# EasyEDA Pro project ProPrj_小车主板_2025-11-23.epro

# Schematic Schematic1
Board Name: Board1; Create Date: 2025-10-30; Page Name: P1; Project Name: 小车主板; Schematic Name: Schematic1; Update Date: 2025-11-07; Company: 嘉立创EDA; Page Size: A4; Version: V1.0
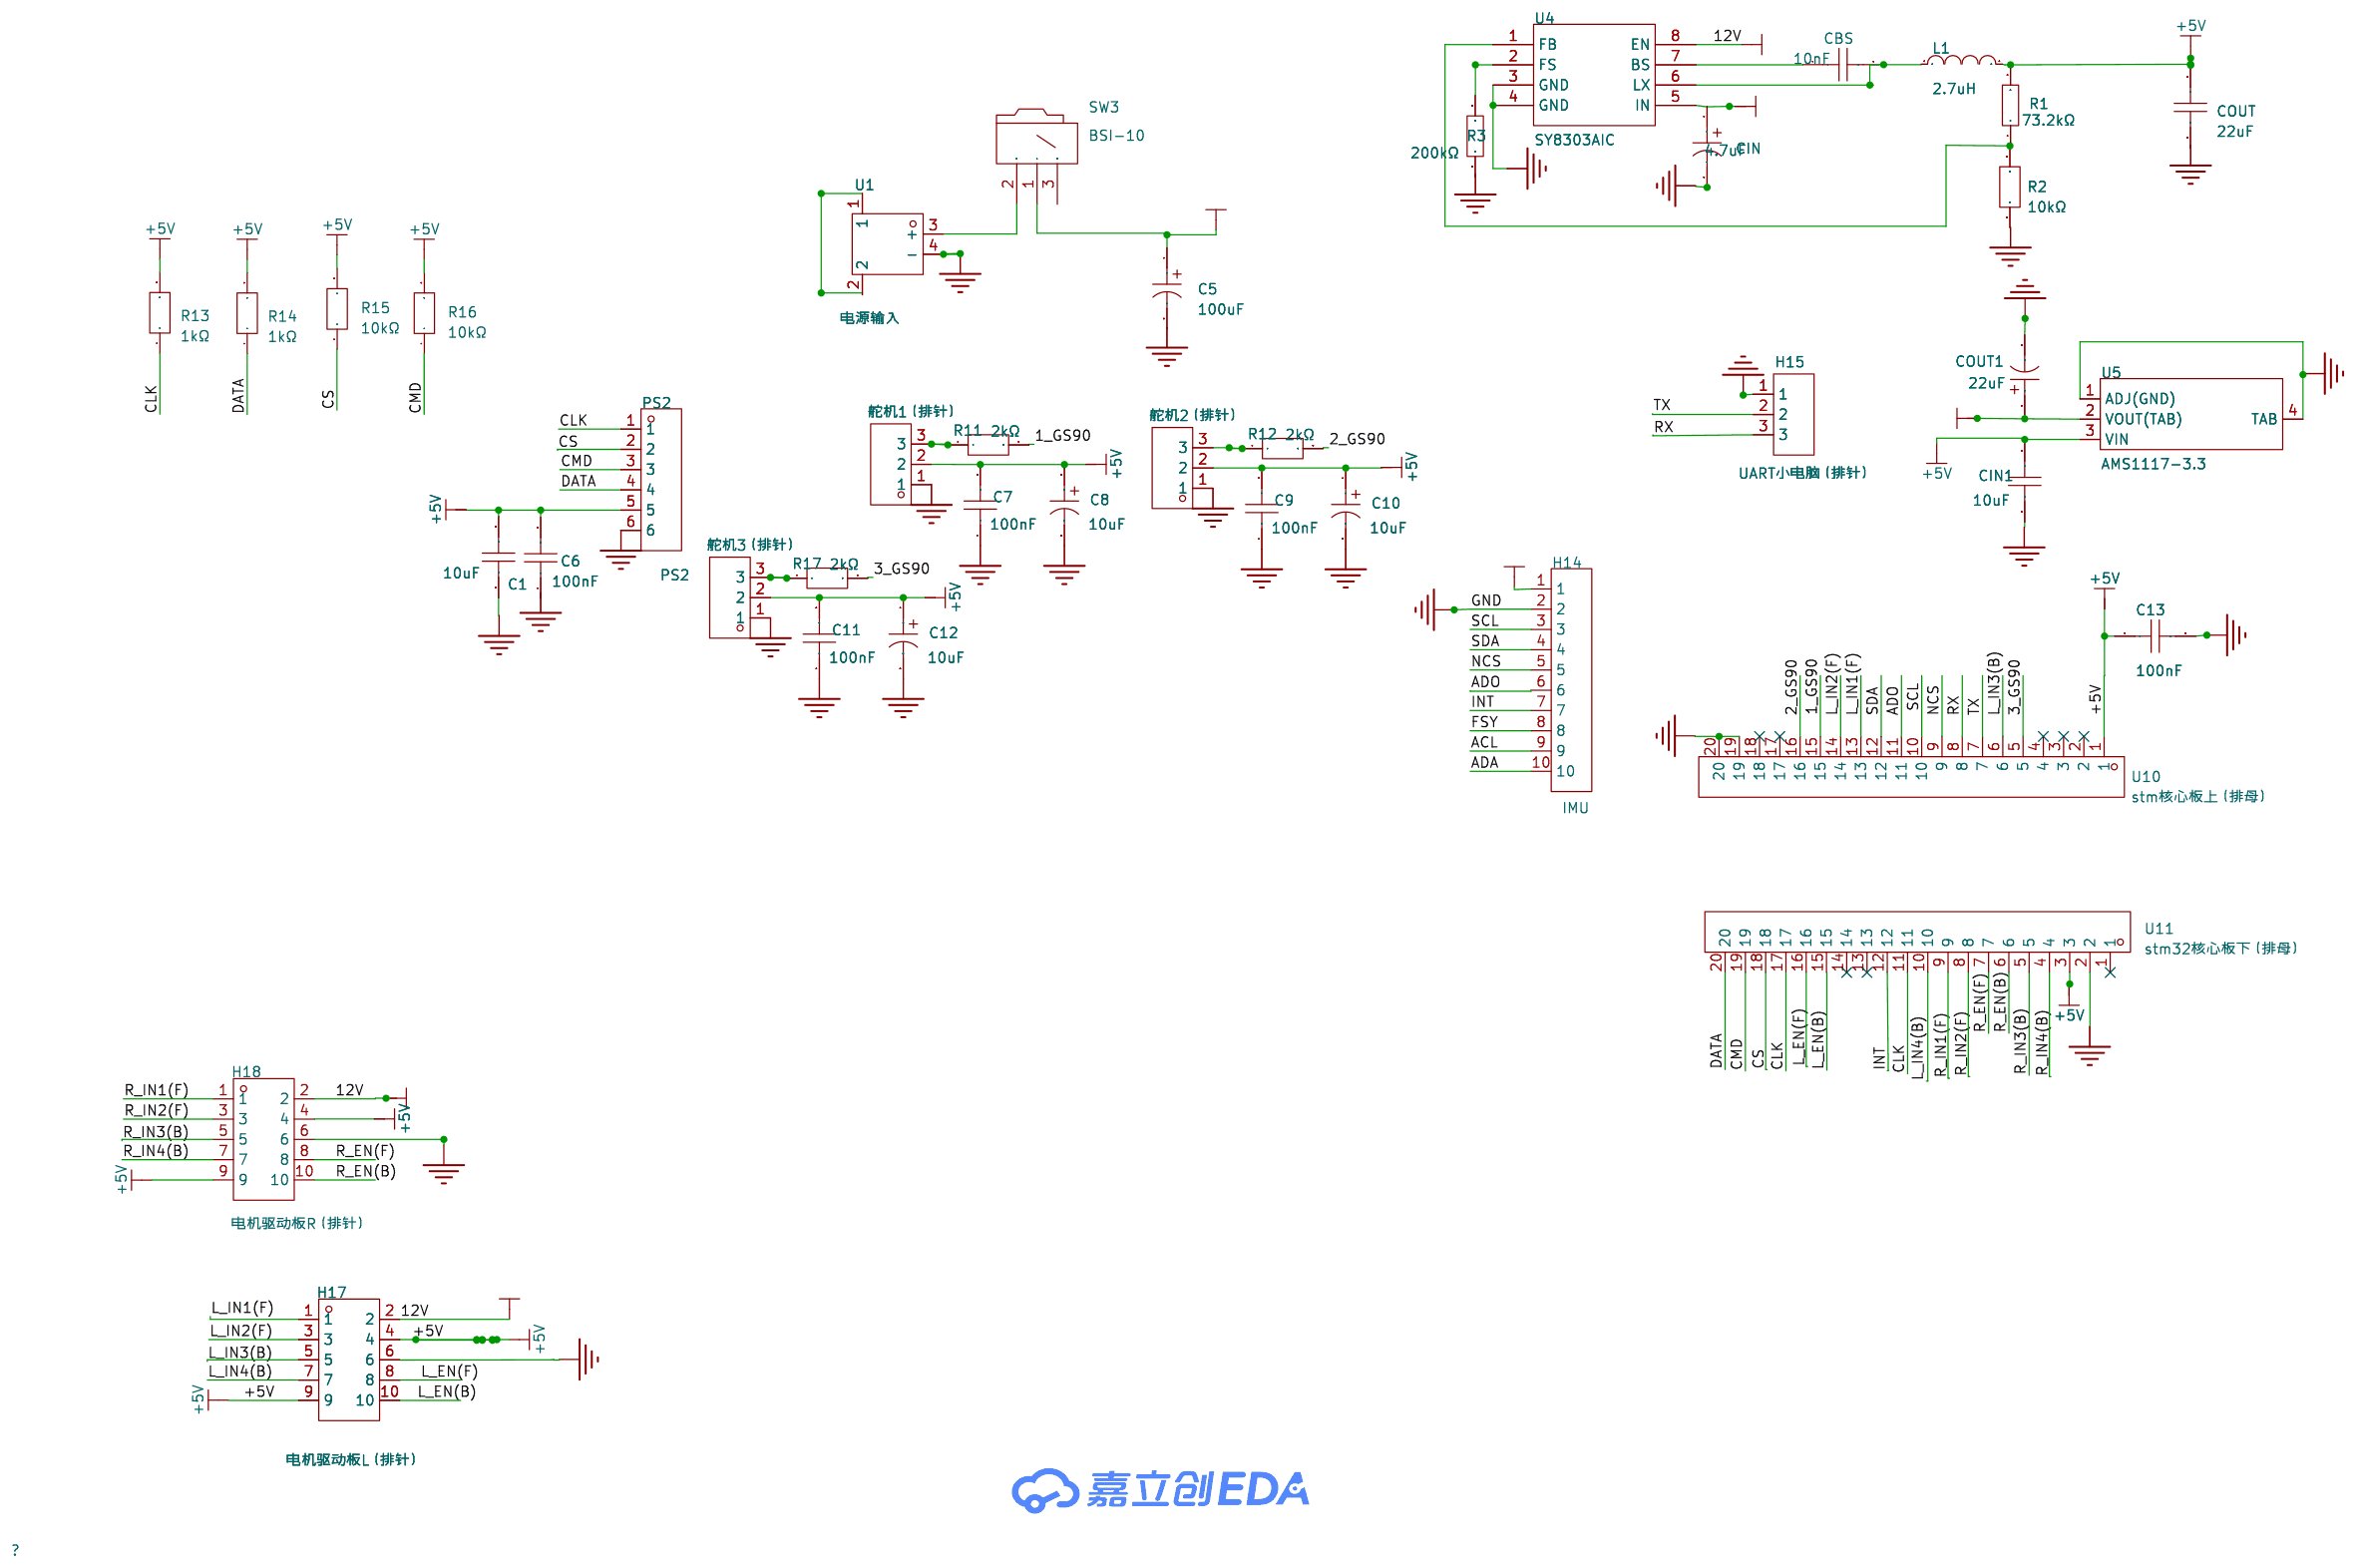
[diagram p0: schematic sheet]

## Parts
C1  10uF  [C1206]
C5  100uF  [CAP-SMD_BD6.3-L6.6-W6.6-FD-1]
C6  100nF  [CAP-TH_L5.0-W2.5-P5.00-D1.0]
C7  100nF  [C0603]
C8  10uF  [CAP-SMD_BD4.0-L4.3-W4.3-FD]
C9  100nF  [C0603]
C10  10uF  [CAP-SMD_BD4.0-L4.3-W4.3-FD]
C11  100nF  [C0603]
C12  10uF  [CAP-SMD_BD4.0-L4.3-W4.3-FD]
C13  100nF  [C0603]
CBS  10nF  [C0402]
CIN  4.7uF  [CAP-SMD_L3.2-W1.6]
CIN1  10uF  [C1206]
COUT  22uF  [C0603]
COUT1  22uF  [CAP-SMD_BD4.0-L4.3-W4.3-FD_1]
H14  IMU  [HDR-TH_10P-P2.54-V-M]
H15  UART小电脑（排针）  [HDR-TH_3P-P2.54-V-M]
H17  电机驱动板L（排针）  [HDR-TH_10P-P2.54-V-M-R2-C5-S2.54-1]
H18  电机驱动板R（排针）  [HDR-TH_10P-P2.54-V-M-R2-C5-S2.54-1]
L1  2.7uH  [IND-SMD_L4.0-W4.0_FNR40XXS]
PS2  PS2  [HDR-TH_6P-P2.54-V-F]
R1  73.2kΩ  [R0402]
R2  10kΩ  [R0603]
R3  200kΩ  [R0603]
R11  2kΩ  [R0603]
R12  2kΩ  [R0603]
R13  1kΩ  [R0603]
R14  1kΩ  [R0603]
R15  10kΩ  [R0603]
R16  10kΩ  [R0603]
R17  2kΩ  [R0603]
SW3  BSI-10  [SW-TH_BSI-10]
U1  电源输入  [TH_2P-XT60PW-F]
U4  SY8303AIC  [TSOT-23-8_L2.9-W1.6-P0.65-LS2.8-BR]
U5  AMS1117-3.3  [SOT-223-4_L6.5-W3.5-P2.30-LS7.0-BR]
U10  stm核心板上（排母）  [HDR-TH_20P-P2.54-V-F]
U11  stm32核心板下（排母）  [HDR-TH_20P-P2.54-V-F]
舵机1（排针）  -  [HDR-TH_3P-P2.54-V-M]
舵机2（排针）  -  [HDR-TH_3P-P2.54-V-M]
舵机3（排针）  -  [HDR-TH_3P-P2.54-V-M]

## Library data of the parts
C1 CIN1 = CL31B106KBHNNNE: 容值:10uF;精度:±10%;额定电压:50V;温度系数:X7R;; LCSC Part Name: 10uF ±10% 50V; Supplier Part: C89632; Manufacturer: SAMSUNG(三星); Supplier Footprint: 1206; JLCPCB Part Class: 扩展库; Datasheet: https://item.szlcsc.com/datasheet/CL31B106KBHNNNE/90812.html; Supplier: LCSC; Tolerance: ±10%; Voltage Rating: 50V; Temperature Coefficient: X7R
C5 = JVJ25V100M6x5: 容值:100uF;精度:±20%;额定电压:25V;纹波电流:72mA@120Hz;; LCSC Part Name: 100uF ±20% 25V; Supplier Part: C46550402; Manufacturer: JIERR(捷而瑞); Supplier Footprint: SMD,D6.3xL5.4mm; JLCPCB Part Class: 扩展库; Datasheet: https://item.szlcsc.com/datasheet/JVJ25V100M6x5/48680096.html; Supplier: LCSC; Tolerance: ±20%; Voltage Rating: 25V; Ripple Current: 72mA@120Hz; Diameter: 6.3mm; Height - Seated (Max): 5.4mm; Lifetime: 2000hrs@105℃; Operating Temperature: -55℃~+105℃
C6 = CC1H104MC1FD3F6C10MF: 容值:100nF;精度:±20%;额定电压:50V;温度系数:Y5V;; LCSC Part Name: 100nF ±20% 50V; Supplier Part: C254085; Manufacturer: Dersonic(德尔创); Supplier Footprint: 插件,P=5.08mm; JLCPCB Part Class: 扩展库; Datasheet: https://item.szlcsc.com/datasheet/CC1H104MC1FD3F6C10MF/248635.html; Supplier: LCSC; Tolerance: ±20%; Voltage Rating: 50V; Pin Spacing: 5.08mm; Temperature Coefficient: Y5V; Diameter: 6mm; Body Thickness: 2.2mm
C7 C9 C11 C13 = CC0603KRX7R9BB104: 容值:100nF;精度:±10%;额定电压:50V;温度系数:X7R;; LCSC Part Name: 100nF ±10% 50V; Supplier Part: C14663; Manufacturer: YAGEO(国巨); Supplier Footprint: 0603; Datasheet: https://item.szlcsc.com/datasheet/CC0603KRX7R9BB104/15331.html; Supplier: LCSC; Tolerance: ±10%; Voltage Rating: 50V; Temperature Coefficient: X7R
C8 C10 C12 = JVJ35V10M4x5: 容值:10uF;精度:±20%;额定电压:35V;纹波电流:14mA@120Hz;; LCSC Part Name: 10uF ±20% 35V; Supplier Part: C46550410; Manufacturer: JIERR(捷而瑞); Supplier Footprint: SMD,D4xL5.4mm; JLCPCB Part Class: 扩展库; Datasheet: https://item.szlcsc.com/datasheet/JVJ35V10M4x5/48680104.html; Supplier: LCSC; Tolerance: ±20%; Voltage Rating: 35V; Ripple Current: 14mA@120Hz; Diameter: 4mm; Height - Seated (Max): 5.4mm; Lifetime: 2000hrs@105℃; Operating Temperature: -55℃~+105℃
CBS = TMK105B7103KVHF: 容值:10nF;精度:±10%;额定电压:25V;材质(温度系数):X7R;; LCSC Part Name: MBAST105SB7103KFNA01 10nF ±10% 25V; Supplier Part: C650944; Manufacturer: TAIYO YUDEN(太诱); Supplier Footprint: 0402; JLCPCB Part Class: 扩展库; Datasheet: https://atta.szlcsc.com/upload/public/pdf/source/20200616/C651025_03129E9EA2F0E607D4931456AA98AFBB.pdf; Supplier: LCSC; Tolerance: ±10%; Voltage Rating: 25V; Temperature Coefficient: X7R
CIN = CA45-A-16V-4.7uF-K_C503895: 容值:4.7uF;精度:±10%;额定电压:16V;等效串联电阻(ESR):4Ω@100kHz;; LCSC Part Name: 4.7uF ±10% 16V; Supplier Part: C503895; Manufacturer: TORCH(火炬); Manufacturer Part: CA45-A-16V-4.7uF-K; Supplier Footprint: CASE-A-3216-16(mm); JLCPCB Part Class: 扩展库; Datasheet: https://item.szlcsc.com/datasheet/CA45-A-16V-4.7uF-K/516604.html; Supplier: LCSC; Tolerance: ±10%; Voltage Rating: 16V; Equivalent Series Resistance(ESR): 4Ω@100kHz; Operating Temperature: -55℃~+125℃
COUT = CL10A226MQ8NRNE: 容值:22uF;精度:±20%;额定电压:6.3V;温度系数:X5R;; LCSC Part Name: 22uF ±20% 6.3V; Supplier Part: C159801; Manufacturer: SAMSUNG(三星); Supplier Footprint: 0603; JLCPCB Part Class: 扩展库; Datasheet: https://item.szlcsc.com/datasheet/CL10A226MQ8NRNE/171181.html; Supplier: LCSC; Tolerance: ±20%; Voltage Rating: 6.3V; Temperature Coefficient: X5R
COUT1 = JVJ16V22M4X5: 容值:22uF;精度:±20%;额定电压:16V;纹波电流:20mA@120Hz;; LCSC Part Name: 22uF ±20% 16V; Supplier Part: C46550398; Manufacturer: JIERR(捷而瑞); Supplier Footprint: SMD,D4xL5.4mm; JLCPCB Part Class: 扩展库; Datasheet: https://item.szlcsc.com/datasheet/JVJ16V22M4X5/48680092.html; Supplier: LCSC; Tolerance: ±20%; Voltage Rating: 16V; Ripple Current: 20mA@120Hz; Diameter: 4mm; Height - Seated (Max): 5.4mm; Lifetime: 2000hrs@105℃; Operating Temperature: -55℃~+105℃
H14 = PZ254V-11-10P: 插针结构:1x10P;间距:2.54mm;行距:-;圆针/方针:方针;安装方式:直插;排数:单排;总PIN位数:10P;额定电流:-;额定电压:-;配合针长度:6mm;塑高:2.5mm;端接针长度:3mm;触头材质:黄铜;触头镀层:-;工作温度:-40℃~+105℃;颜色:黑色;; LCSC Part Name: 1x10P 间距:2.54mm 方针 直插; Supplier Part: C492409; Manufacturer: XFCN(兴飞); Supplier Footprint: 插件,P=2.54mm; JLCPCB Part Class: 扩展库; Datasheet: https://atta.szlcsc.com/upload/public/pdf/source/20200309/C492409_129C9431BDD62EBBBD0A643B6AAB9FBD.pdf; Supplier: LCSC; Pin Structure: 1x10P; Pitch: 2.54mm; Circluar Pins/Square Pins: 方针; Mounting Type: 直插; Number of Rows: 单排; Number of Pins: 10P; Length of Mating Pin: 6mm; Insulation Height: 2.5mm; Length of End Connection Pin: 3mm; Contact Material: 黄铜; Operating Temperature: -40℃~+105℃; Color: 黑色
H15 = PZ254V-11-03P: 插针结构:1x3P;间距:2.54mm;行距:-;圆针/方针:方针;安装方式:直插;排数:单排;总PIN位数:3P;额定电流:3A;额定电压:250V;配合针长度:6mm;塑高:2.5mm;端接针长度:3mm;工作温度:-40℃~+105℃;颜色:黑色;; LCSC Part Name: 1x3P 间距:2.54mm 方针 直插; Supplier Part: C2937625; Manufacturer: XFCN(兴飞); Supplier Footprint: 插件,P=2.54mm; JLCPCB Part Class: 扩展库; Datasheet: https://item.szlcsc.com/datasheet/PZ254V-11-03P/3293280.html; Supplier: LCSC; Pin Structure: 1x3P; Pitch: 2.54mm; Circluar Pins/Square Pins: 方针; Mounting Type: 直插; Number of Rows: 单排; Number of Pins: 3P; Current Rating: 3A; Voltage Rating (Max): 250V; Length of Mating Pin: 6mm; Insulation Height: 2.5mm; Length of End Connection Pin: 3mm; Operating Temperature: -40℃~+105℃; Color: 黑色
H17 H18 = PZ2.54-2*5: 插针结构:2x5P;间距:2.54mm;行距:2.54mm;圆针/方针:方针;安装方式:直插;排数:双排;总PIN位数:10P;额定电流:2.5A;配合针长度:6mm;塑高:2.54mm;端接针长度:3mm;触头材质:黄铜;触头镀层:金;工作温度:-40℃~+105℃;; LCSC Part Name: 2x5P 间距:2.54mm 方针 直插; Supplier Part: C5156677; Manufacturer: ZHOURI(洲日); Supplier Footprint: 插件,P=2.54mm; Datasheet: https://item.szlcsc.com/datasheet/PZ2.54-2*5/5790846.html; Supplier: LCSC; Pin Structure: 2x5P; Pitch: 2.54mm; Row Spacing: 2.54mm; Circluar Pins/Square Pins: 方针; Mounting Type: 直插; Number of Rows: 双排; Number of Pins: 10P; Current Rating: 2.5A; Length of Mating Pin: 6mm; Insulation Height: 2.54mm; Length of End Connection Pin: 3mm; Contact Material: 黄铜; Contact Plating: 金; Operating Temperature: -40℃~+105℃
L1 = FNR4012S2R7NT: 电感值:2.7uH;精度:±30%;额定电流:1.7A;饱和电流(Isat):2.3A;; LCSC Part Name: 2.7uH ±30% 2.3A; Supplier Part: C167777; Manufacturer: cjiang(长江微电); Supplier Footprint: SMD,4x4mm; JLCPCB Part Class: 扩展库; Datasheet: https://atta.szlcsc.com/upload/public/pdf/source/20190327/C167925_9EFF0AABC4CA629C2CC95961DBF7D39D.pdf; Supplier: LCSC; Tolerance: ±30%; Rated Current: 1.7A; Saturation Current (Isat): 2.3A; DC Resistance (DCR): 117mΩ
PS2 = 2.54-1*6P母: 插孔结构:1x6P;间距:2.54mm;行距:-;圆孔/方孔:方孔;安装方式:直插;排数:单排;总孔位数:6P;额定电流:3A;额定电压:-;插孔方向:顶部;塑高:-;触头材质:-;触头镀层:-;工作温度:-40℃~+105℃;; LCSC Part Name: 1x6P 间距:2.54mm 直插; Supplier Part: C40877; Manufacturer: BOOMELE(博穆精密); Supplier Footprint: 插件,P=2.54mm; JLCPCB Part Class: 扩展库; Datasheet: https://item.szlcsc.com/datasheet/2.54-1*6P%25E6%25AF%258D/41861.html; Supplier: LCSC; Holes Structure: 1x6P; Pitch: 2.54mm; Circular Hole / Square Hole: 方孔; Mounting Type: 直插; Number of Rows: 单排; Number of Positions: 6P; Current Rating: 3A; Holes Direction: 顶部; Operating Temperature: -40℃~+105℃
R1 = 0402WGF7322TCE: 电阻类型:厚膜电阻;阻值:73.2kΩ;精度:±1%;功率:62.5mW;工作电压:50V;温度系数:±100ppm/℃;; LCSC Part Name: 73.2kΩ ±1% 62.5mW 厚膜电阻; Supplier Part: C26986; Manufacturer: UNI-ROYAL(厚声); Supplier Footprint: 0402; JLCPCB Part Class: 扩展库; Datasheet: https://item.szlcsc.com/datasheet/0402WGF7322TCE/27735.html; Supplier: LCSC; Type: 厚膜电阻; Tolerance: ±1%; Power(Watts): 62.5mW; Voltage-Supply(Max): 50V; Temperature Coefficient: ±100ppm/℃; Operating Temperature: -55℃~+155℃
R2 R15 R16 = FRC0603J103 TS: 电阻类型:厚膜电阻;阻值:10kΩ;精度:±5%;功率:100mW;工作电压:75V;温度系数:±100ppm/℃;; LCSC Part Name: 10kΩ ±5% 100mW 厚膜电阻; Supplier Part: C2930027; Manufacturer: FOJAN(富捷); Supplier Footprint: 0603; JLCPCB Part Class: 扩展库; Datasheet: https://item.szlcsc.com/datasheet/FRC0603J103%2520TS/3266960.html; Supplier: LCSC; Type: 厚膜电阻; Tolerance: ±5%; Power(Watts): 100mW; Voltage-Supply(Max): 75V; Temperature Coefficient: ±100ppm/℃; Operating Temperature: -55℃~+155℃
R3 = 0603WAF2003T5E: 电阻类型:厚膜电阻;阻值:200kΩ;精度:±1%;功率:100mW;最大工作电压:75V;温度系数:±100ppm/℃;; LCSC Part Name: 200kΩ ±1% 100mW 厚膜电阻; Supplier Part: C25811; Manufacturer: UNI-ROYAL(厚声); Supplier Footprint: 0603; JLCPCB Part Class: 基础库; Datasheet: https://atta.szlcsc.com/upload/public/pdf/source/20200306/C422600_1E6D84923E4A46A82E41ADD87F860B5C.pdf; Supplier: LCSC; Type: 厚膜电阻; Tolerance: ±1%; Power(Watts): 100mW; Overload Voltage (Max): 75V; Temperature Coefficient: ±100ppm/℃; Operating Temperature Range: -55℃~+155℃
R11 R12 R17 = FRC0603J202 TS: 电阻类型:厚膜电阻;阻值:2kΩ;精度:±5%;功率:100mW;工作电压:75V;温度系数:±100ppm/℃;; LCSC Part Name: 2kΩ ±5% 100mW 厚膜电阻; Supplier Part: C2907137; Manufacturer: FOJAN(富捷); Supplier Footprint: 0603; Supplier: LCSC; Type: 厚膜电阻; Tolerance: ±5%; Power(Watts): 100mW; Voltage-Supply(Max): 75V; Temperature Coefficient: ±100ppm/℃; Operating Temperature: -55℃~+155℃
R13 R14 = FRC0603F1001TS: 电阻类型:厚膜电阻;阻值:1kΩ;精度:±1%;功率:100mW;工作电压:75V;温度系数:±100ppm/℃;; LCSC Part Name: 1kΩ ±1% 100mW 厚膜电阻; Supplier Part: C2907002; Manufacturer: FOJAN(富捷); Supplier Footprint: 0603; JLCPCB Part Class: 扩展库; Supplier: LCSC; Type: 厚膜电阻; Tolerance: ±1%; Power(Watts): 100mW; Voltage-Supply(Max): 75V; Temperature Coefficient: ±100ppm/℃; Operating Temperature: -55℃~+155℃
SW3 = BSI-10: 电路结构:单刀双掷;安装方式:直插;开关颜色:红色;额定电流:500mA;额定电压:12V;工作寿命:1千次;; LCSC Part Name: 滑动开关; Supplier Part: C2985934; Manufacturer: SM Switch; Supplier Footprint: 插件,10x2.5mm; JLCPCB Part Class: 扩展库; Datasheet: https://item.szlcsc.com/datasheet/BSI-10/3431186.html; Supplier: LCSC; Circuit: 单刀双掷; Termination Style: PC引脚; Length: 10mm; Width: 2.5mm; Switch Height: 6.4mm; Mounting Type: 直插; Actuator Color: 红色; Current Rating: 500mA; Voltage Rating: 12V; Life: 1千次; Operating Temperature: -40℃~+85℃
U1 = XT60PW-F: 类别:-;类型1:-;; LCSC Part Name: AMASS(艾迈斯)插头连接器锂电池组充电接口 航模电调卧式焊板 母头 XT60PW-F; Supplier Part: C428722; Manufacturer: AMASS(艾迈斯); JLCPCB Part Class: 扩展库; Datasheet: https://item.szlcsc.com/datasheet/XT60PW-F/423834.html; Supplier: LCSC; Type: 卧式插头; Colour: 黄色; InterfaceType: 母头
U4 = SY8303AIC: 功能类型:降压型;输出类型:-;工作电压:4.5V~40V;输出电压:-;输出电流:-;; LCSC Part Name: 高效率快速响应3A 40V输入同步降压调节器; Supplier Part: C97054; Manufacturer: silergy(矽力杰); Supplier Footprint: TSOT-23-8; JLCPCB Part Class: 扩展库; Datasheet: https://atta.szlcsc.com/upload/public/pdf/source/20170308/1488958431714.pdf; Supplier: LCSC; Function: 降压型; Input Voltage: 4.5V~40V; Switching Frequency: 500kHz~2.5MHz; Operating Temperature: -40℃~+105℃; Synchronous Rectification: 是; Number of Outputs: 1; Topology: 降压式; Quiescent Current (Iq): 18uA
U5 = AMS1117-3.3_C347222: 输出类型:固定;工作电压:12V;输出电压:3.3V;输出电流:1A;电源纹波抑制比(PSRR):60dB@(120Hz);输出极性:正极;; LCSC Part Name: 输出:3.3V 电流:1A 耐压:12V; Supplier Part: C347222; Manufacturer: UMW(友台半导体); Supplier Footprint: SOT-223; Datasheet: https://item.szlcsc.com/datasheet/AMS1117-3.3/323882.html; Supplier: LCSC; Output Type: 固定; Voltage - Supply: 12V; Output Voltage: 3.3V; Output Current: 1A; Power Supply Rejection Ratio (PSRR): 60dB@(120Hz); Voltage Dropout: 1.3V@(1A); Features: 过流保护; Output Configuration: 正极; Number of Outputs: 1
U10 U11 = ZX-PM2.54-1-20PY: 插孔结构:1x20P;间距:2.54mm;行距:-;圆孔/方孔:方孔;安装方式:直插;排数:单排;总孔位数:20P;额定电流:3A;额定电压:-;插孔方向:顶部;塑高:8.5mm;触头材质:-;触头镀层:金;工作温度:-40℃~+105℃;; LCSC Part Name: 1x20P 间距:2.54mm 直插; Supplier Part: C7499336; Manufacturer: Megastar(兆星); Supplier Footprint: 插件,P=2.54mm; JLCPCB Part Class: 扩展库; Datasheet: https://item.szlcsc.com/datasheet/ZX-PM2.54-1-20PY/8573997.html; Supplier: LCSC; Holes Structure: 1x20P; Pitch: 2.54mm; Circular Hole / Square Hole: 方孔; Mounting Type: 直插; Number of Rows: 单排; Number of Positions: 20P; Current Rating: 3A; Holes Direction: 顶部; Insulation Height: 8.5mm; Contact Plating: 金; Operating Temperature: -40℃~+105℃; PIN Length: 3.2mm
舵机1（排针） 舵机2（排针） 舵机3（排针） = HDR-M_2.54_1x3P: Supplier Part: C2937625; Supplier Footprint: 插件; JLCPCB Part Class: 扩展库

## Nets
3.3V: COUT1.1 H14.1 U5.2(VOUT(TAB))
12V: C5.1 H17.2 H18.2 SW3.1 U4.5(IN) U4.8(EN)
+5V: C1.2 C6.2 C7.2 C8.1 C9.2 C10.1 C11.2 C12.1 C13.1 CIN1.2 H17.4 H17.9 H18.9 L1.2 PS2.5 R1.2 R13.2 R14.2 U5.3(VIN) U10.1 U11.3 舵机1（排针）.2 舵机2（排针）.2 舵机3（排针）.2
GND: C1.1 C5.2 C6.1 C7.1 C8.2 C9.1 C10.2 C11.1 C12.2 C13.2 CIN.2 CIN1.1 COUT.2 COUT1.2 H14.2 H15.1 H18.6 PS2.6 R2.1 U1.4(-) U4.3(GND) U4.4(GND) U5.1(ADJ(GND)) U5.4(TAB) U10.19 U10.20 U11.2 舵机1（排针）.1 舵机2（排针）.1 舵机3（排针）.1
1_GS90: U10.15
2_GS90: U10.16
3_GS90: U10.5
ACL: H14.9
ADA: H14.10
ADO: H14.6 U10.11
CLK: PS2.1 R13.1 U11.11 U11.17
CMD: PS2.3 U11.19
CS: PS2.2 U11.18
DATA: PS2.4 R14.1 U11.20
FSY: H14.8
INT: H14.7 U11.12
L_EN(B): H17.10
L_EN(F): H17.8 U11.16
L_IN1(F): H17.1 U10.13
L_IN2(F): H17.3 U10.14
L_IN3(B): H17.5 U10.6
L_IN4(B): H17.7 U11.10
NCS: H14.5 U10.9
R_EN(B): H18.10 U11.6
R_EN(F): H18.8 U11.7
R_IN1(F): H18.1 U11.9
R_IN2(F): H18.3 U11.8
R_IN3(B): H18.5 U11.5
R_IN4(B): H18.7 U11.4
RX: H15.3 U10.8
SCL: H14.3 U10.10
SDA: H14.4 U10.12
TX: H15.2 U10.7
$1N8242: U1.1 U1.2
$1N14520: R11.1 舵机1（排针）.3
$1N14637: R12.1 舵机2（排针）.3
$1N15469: R17.1 舵机3（排针）.3
$1N18529: SW3.2 U1.3(+)
Net-(CBS-2): CBS.2 U4.6(LX)
Net-(R2-2): R2.2 U4.1(FB)

Not connected (* = marked no-connect by the designer): CBS 1; CIN 1; COUT 1; H17 6; H18 4; L1 1; R1 1; R3 1 2; R11 2; R12 2; R15 1 2; R16 1 2; R17 2; SW3 3; U4 2(FS) 7(BS); U10 2* 3* 4* 17* 18*; U11 1* 13* 14* 15

# Board PCB1
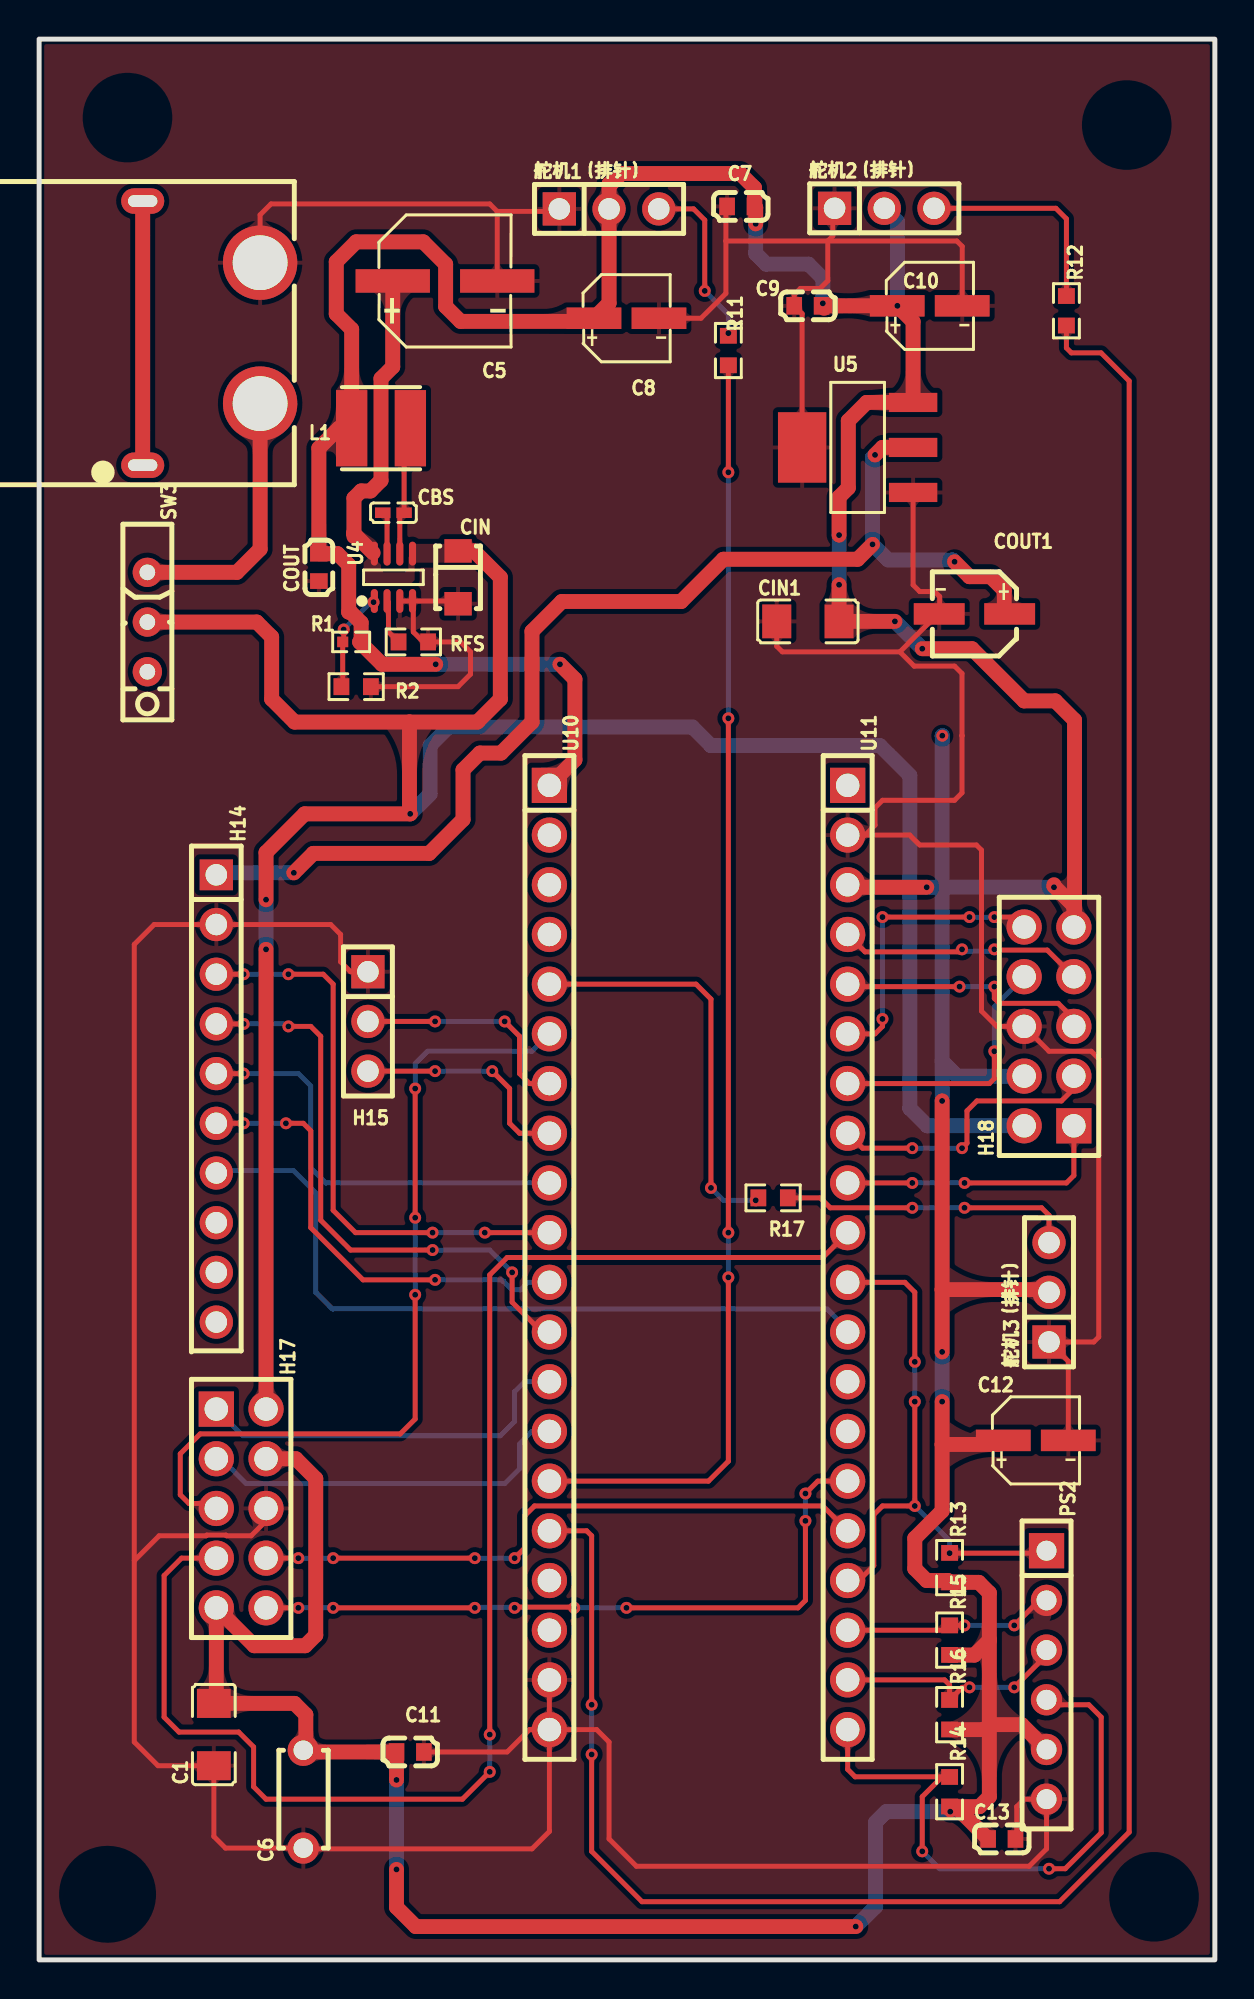
[diagram p1: board, top side]
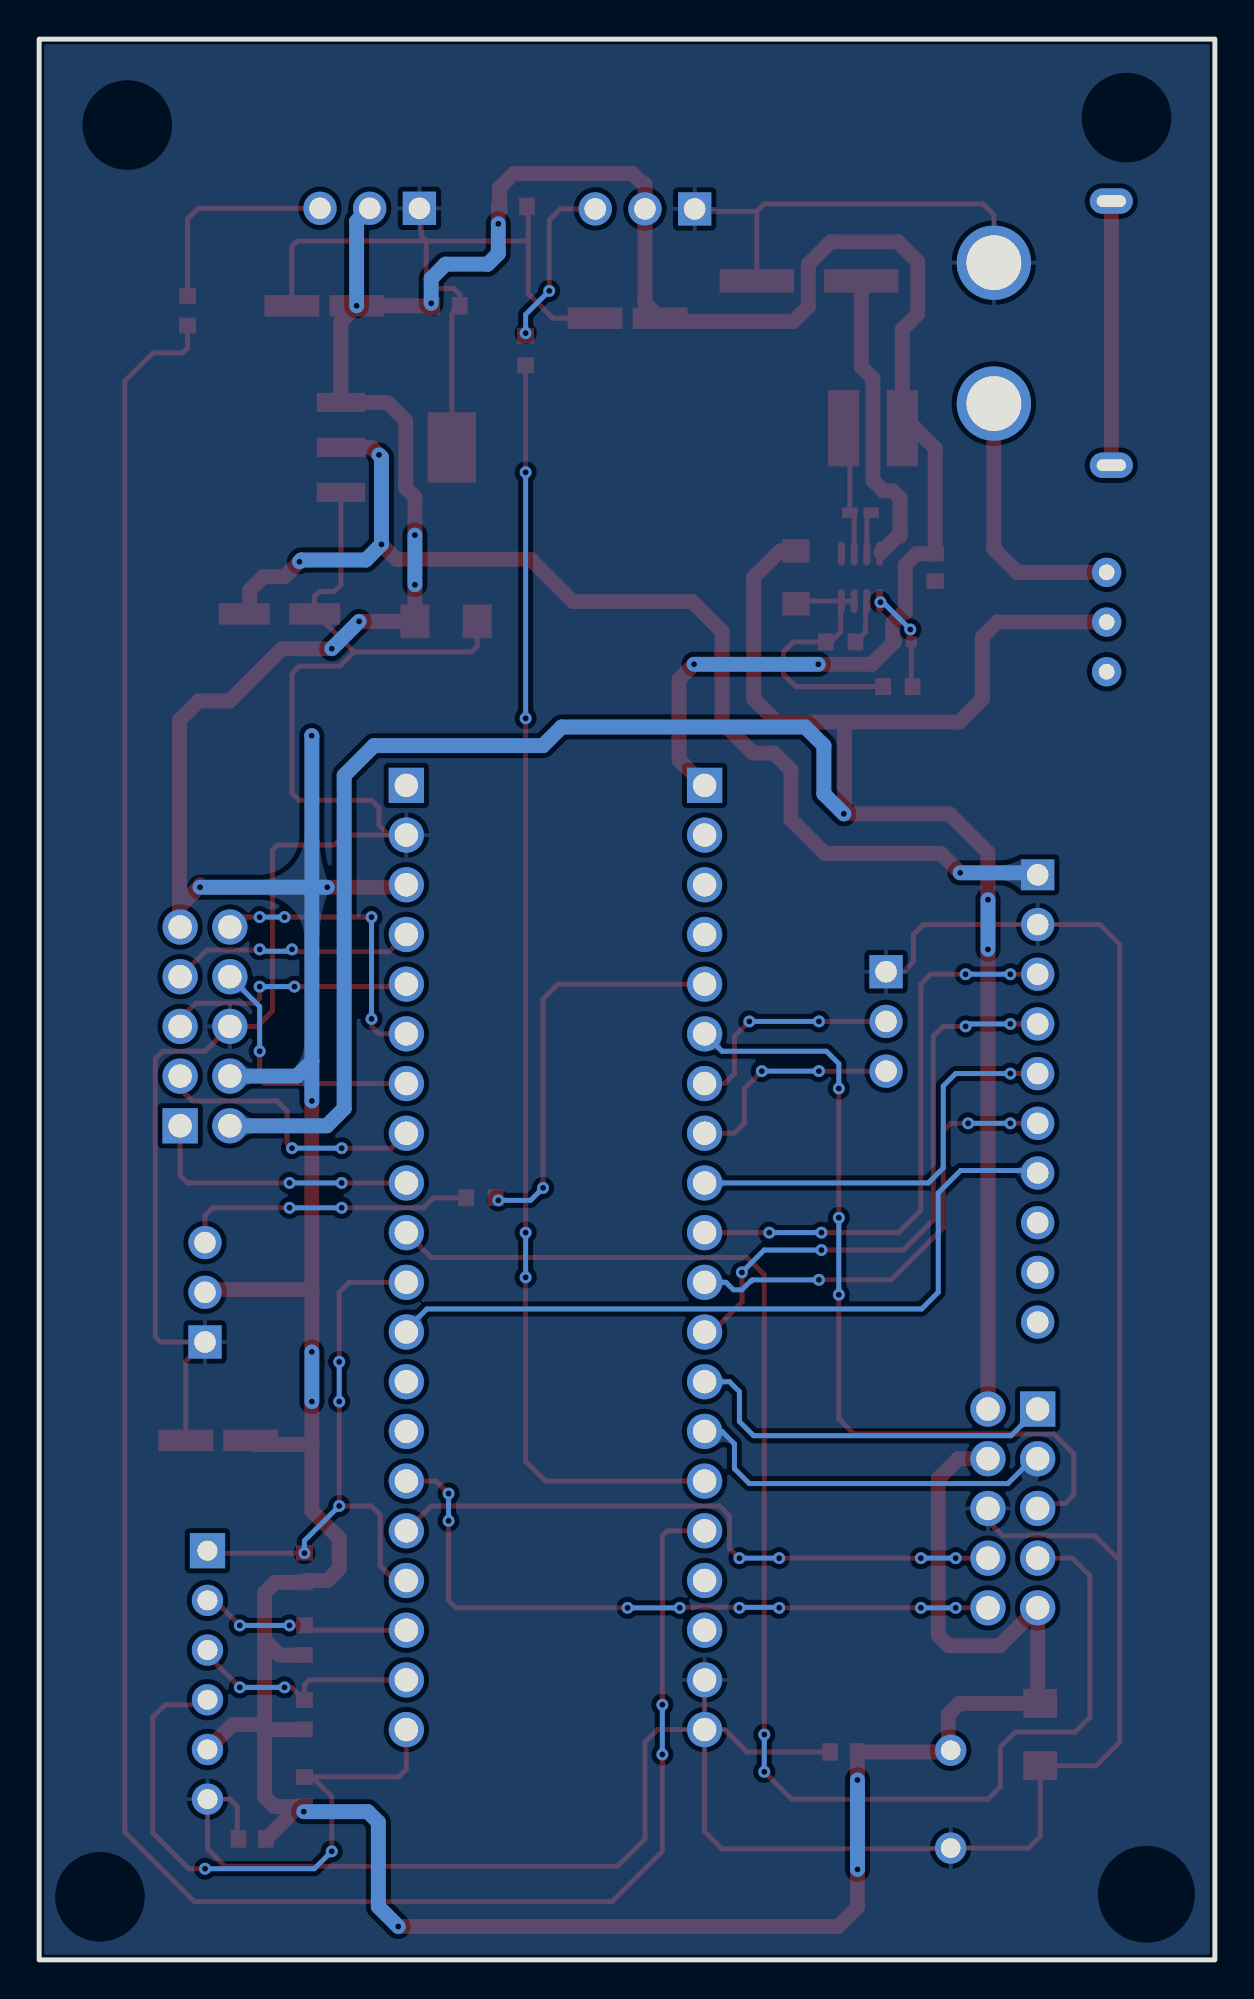
[diagram p2: board, bottom side, seen from below]

Outline 60.07 x 98.17 mm; copper layers: Top Layer, Bottom Layer. Coordinates in mm from the lower left corner of the outline.
Outline path: rectangle 0,98.17 60.07,0
Stack: Top Layer 0.035mm / Dielectric1 1.51mm FR4 er 4.5 / Bottom Layer 0.035mm

## Design rules (mm)
template: JLCPCB Capability(Two Layers Board)
spacing copperThickness1oz (default): track to track 0.102, other pairs 0.152 to 0.3
spacing copperThickness2oz: track to track 0.203, other pairs 0.152 to 0.3
track width copperThickness1oz (default): min 0.127, default 0.254, max 2.54
track width copperThickness2oz: min 0.203, default 0.254, max 2.54
differential pair differentialPair (default): width min 0.127, default 0.254, max 2.54; gap min 0.152, default 0.152
via viaSize (default): diameter min 0.5, default 0.61, max 10; hole min 0.3, default 0.305, max 6.3

## Placement (name value [footprint] x y rotation side)
C1  10uF  [C1206]  8.93 11.52 90 top
C5  100uF  [CAP-SMD_BD6.3-L6.6-W6.6-FD-1]  20.74 85.81 0 top
C6  100nF  [CAP-TH_L5.0-W2.5-P5.00-D1.0]  13.5 8.21 90 top
C7  100nF  [C0603]  35.85 89.62 0 top
C8  10uF  [CAP-SMD_BD4.0-L4.3-W4.3-FD]  30.01 83.91 0 top
C9  100nF  [C0603]  39.28 84.54 0 top
C10  10uF  [CAP-SMD_BD4.0-L4.3-W4.3-FD]  45.5 84.54 0 top
C11  100nF  [C0603]  18.96 10.63 180 top
C12  10uF  [CAP-SMD_BD4.0-L4.3-W4.3-FD]  50.92 26.55 0 top
C13  100nF  [C0603]  49.19 6.18 0 top
CBS  10nF  [C0402]  18.1 73.97 0 top
CIN  4.7uF  [CAP-SMD_L3.2-W1.6]  21.4 70.66 270 top
CIN1  10uF  [C1206]  39.28 68.41 0 top
COUT  22uF  [C0603]  14.29 71.17 270 top
COUT1  22uF  [CAP-SMD_BD4.0-L4.3-W4.3-FD_1]  47.79 68.79 180 top
H14  IMU  [HDR-TH_10P-P2.54-V-M]  9.05 44.03 270 top
H15  UART小电脑（排针）  [HDR-TH_3P-P2.54-V-M]  16.8 47.96 270 top
H17  电机驱动板L（排针）  [HDR-TH_10P-P2.54-V-M-R2-C5-S2.54-1]  10.32 23.07 270 top
H18  电机驱动板R（排针）  [HDR-TH_10P-P2.54-V-M-R2-C5-S2.54-1]  51.6 47.71 90 top
L1  2.7uH  [IND-SMD_L4.0-W4.0_FNR40XXS]  17.47 78.28 180 top
PS2  PS2  [HDR-TH_6P-P2.54-V-F]  51.47 14.56 270 top
R1  73.2kΩ  [R0402]  15.94 67.36 0 top
R2  10kΩ  [R0603]  16.2 65.08 180 top
R11  2kΩ  [R0603]  35.22 82.25 270 top
R12  2kΩ  [R0603]  52.49 84.29 270 top
R13  1kΩ  [R0603]  46.52 20.05 270 top
R14  1kΩ  [R0603]  46.52 8.59 270 top
R15  10kΩ  [R0603]  46.52 16.34 270 top
R16  10kΩ  [R0603]  46.52 12.53 270 top
R17  2kΩ  [R0603]  37.5 38.95 180 top
RFS  200kΩ  [R0603]  19.12 67.36 180 top
SW3  BSI-10  [SW-TH_BSI-10]  5.53 68.38 270 top
U1  电源输入  [TH_2P-XT60PW-F]  8.29 83.14 90 top
U4  SY8303AIC  [TSOT-23-8_L2.9-W1.6-P0.65-LS2.8-BR]  18.1 70.66 270 top
U5  AMS1117-3.3  [SOT-223-4_L6.5-W3.5-P2.30-LS7.0-BR]  41.82 77.3 0 top
U10  stm核心板上（排母）  [HDR-TH_20P-P2.54-V-F]  26.07 35.9 270 top
U11  stm32核心板下（排母）  [HDR-TH_20P-P2.54-V-F]  41.31 35.9 270 top
舵机1（排针）  -  [HDR-TH_3P-P2.54-V-M]  29.12 89.49 0 top
舵机2（排针）  -  [HDR-TH_3P-P2.54-V-M]  43.18 89.52 0 top
舵机3（排针）  -  [HDR-TH_3P-P2.54-V-M]  51.6 34.12 90 top

## Footprints (pads in the part's own frame, mm; a bottom-side part is the same pattern mirrored in y, then rotated)
C0402
  rect 0.79x0.54 smd: 1(-0.545,0) 2(0.545,0)
C0603
  rect 0.8x0.9 smd: 1(-0.7,0) 2(0.7,0)
C1206
  rect 1.485x1.728 smd: 1(-1.593,0) 2(1.593,0)
CAP-SMD_BD4.0-L4.3-W4.3-FD
  rect 2.8x1.1 smd: 1(-1.661,0) 2(1.661,0)
CAP-SMD_BD4.0-L4.3-W4.3-FD_1
  rect 2.6x1.1 smd: 1(-1.8,0) 2(1.8,0)
CAP-SMD_BD6.3-L6.6-W6.6-FD-1
  rect 3.8x1.2 smd: 1(-2.67,0) 2(2.67,0)
CAP-SMD_L3.2-W1.6
  rect 1.2x1.4 smd: 1(-1.35,0) 2(1.35,0)
CAP-TH_L5.0-W2.5-P5.00-D1.0
  round 1.6 hole 1: 1(-2.5,0) 2(2.5,0)
HDR-TH_3P-P2.54-V-M
  rect 1.7x1.7 hole 1.1: 1(-2.54,0)
  round 1.7 hole 1.1: 2(0,0) 3(2.54,0)
HDR-TH_6P-P2.54-V-F
  rect 1.8x1.8 hole 1.02: 1(-6.35,0)
  round 1.6 hole 1.02: 2(-3.81,0) 3(-1.27,0) 4(1.27,0) 5(3.81,0) 6(6.35,0)
HDR-TH_10P-P2.54-V-M
  rect 1.575x1.7 hole 1.1: 1(-11.43,0)
  round 1.7 hole 1.1: 2(-8.89,0) 3(-6.35,0) 4(-3.81,0) 5(-1.27,0) 6(1.27,0) 7(3.81,0) 8(6.35,0) 9(8.89,0) 10(11.43,0)
HDR-TH_10P-P2.54-V-M-R2-C5-S2.54-1
  rect 1.8x1.8 hole 1.2: 1(-5.08,-1.27)
  round 1.8 hole 1.2: 2(-5.08,1.27) 3(-2.54,-1.27) 4(-2.54,1.27) 5(0,-1.27) 6(0,1.27) 7(2.54,-1.27) 8(2.54,1.27) 9(5.08,-1.27) 10(5.08,1.27)
HDR-TH_20P-P2.54-V-F
  rect 1.8x1.8 hole 1.2: 1(-24.13,0)
  round 1.8 hole 1.2: 2(-21.59,0) 3(-19.05,0) 4(-16.51,0) 5(-13.97,0) 6(-11.43,0) 7(-8.89,0) 8(-6.35,0) 9(-3.81,0) 10(-1.27,0) 11(1.27,0) 12(3.81,0) 13(6.35,0) 14(8.89,0) 15(11.43,0) 16(13.97,0) 17(16.51,0) 18(19.05,0) 19(21.59,0) 20(24.13,0)
IND-SMD_L4.0-W4.0_FNR40XXS
  rect 1.6x3.9 smd: 1(-1.5,0) 2(1.5,0)
R0402
  rect 0.566x0.54 smd: 1(-0.433,0) 2(0.433,0)
R0603
  rect 0.806x0.864 smd: 1(-0.753,0) 2(0.753,0)
SOT-223-4_L6.5-W3.5-P2.30-LS7.0-BR
  rect 2.47x0.98 smd: 1(2.835,-2.3) 2(2.835,0) 3(2.835,2.3)
  rect 2.47x3.6 smd: 4(-2.835,0)
SW-TH_BSI-10
  round 1.5 hole 0.8: 1(0,0) 2(-2.54,0) 3(2.54,0)
TH_2P-XT60PW-F
  oval 1.3x2.2 hole 0.6x1.5: 1(-6.75,3) 2(6.75,3)
  round 3.8 hole 2.8: 3(-3.6,-3) 4(3.6,-3)
TSOT-23-8_L2.9-W1.6-P0.65-LS2.8-BR
  oval 1.222x0.364 smd: 1(1.211,-0.975) 2(1.211,-0.325) 3(1.211,0.325) 4(1.211,0.975) 5(-1.211,0.975) 6(-1.211,0.325) 7(-1.211,-0.325) 8(-1.211,-0.975)

## Nets
3.3V: COUT1.1 H14.1 U5.2
12V: C5.1 CIN.1 H17.2 H18.2 SW3.1 U4.5 U4.8
+5V: C1.2 C6.2 C7.2 C8.1 C9.2 C10.1 C11.2 C12.1 C13.1 CIN1.2 COUT.1 H17.4 H17.9 H18.4 H18.9 L1.2 PS2.5 R1.2 R13.2 R14.2 R15.2 R16.2 U5.3 U10.1 U11.3 舵机1（排针）.2 舵机2（排针）.2 舵机3（排针）.2
GND: C1.1 C5.2 C6.1 C7.1 C8.2 C9.1 C10.2 C11.1 C12.2 C13.2 CIN.2 CIN1.1 COUT.2 COUT1.2 H14.2 H15.1 H17.6 H18.6 PS2.6 R2.1 RFS.1 U1.4 U4.3 U4.4 U5.1 U5.4 U10.19 U10.20 U11.2 舵机1（排针）.1 舵机2（排针）.1 舵机3（排针）.1
1_GS90: R11.2 U10.15
2_GS90: R12.2 U10.16
3_GS90: R17.2 U10.5
ACL: H14.9
ADA: H14.10
ADO: H14.6 U10.11
CLK: PS2.1 R13.1 U11.11 U11.17
CMD: PS2.3 R16.1 U11.19
CS: PS2.2 R15.1 U11.18
DATA: PS2.4 R14.1 U11.20
FSY: H14.8
INT: H14.7 U11.12
L_EN(B): H17.10 U11.15
L_EN(F): H17.8 U11.16
L_IN1(F): H17.1 U10.13
L_IN2(F): H17.3 U10.14
L_IN3(B): H17.5 U10.6
L_IN4(B): H17.7 U11.10
NCS: H14.5 U10.9
R_EN(B): H18.10 U11.6
R_EN(F): H18.8 U11.7
R_IN1(F): H18.1 U11.9
R_IN2(F): H18.3 U11.8
R_IN3(B): H18.5 U11.5
R_IN4(B): H18.7 U11.4
RX: H15.3 U10.8
SCL: H14.3 U10.10
SDA: H14.4 U10.12
TX: H15.2 U10.7
$1N4224: CBS.1 U4.7
$1N4461: RFS.2 U4.2
$1N4835: CBS.2 L1.1 U4.6
$1N8242: U1.1 U1.2
$1N14520: R11.1 舵机1（排针）.3
$1N14637: R12.1 舵机2（排针）.3
$1N15469: R17.1 舵机3（排针）.3
$1N18529: SW3.2 U1.3
$1N18556: R1.1 R2.2 U4.1

Pads without a net: SW3 3; U10 2 3 4 17 18; U11 1 13 14

## Via types
v1: diameter 0.61, hole 0.305, Top Layer to Bottom Layer, 96 vias

## Routing (per net, layer and track width the routed paths; a pad name or vN(x,y) marks a point on that pad's centre or on a via; arc(x,y) is an arc through that point)
3.3V: length 60.5
  Top Layer w0.762: U5.2 43.09,77.3 v1(42.71,76.92) ; COUT1.1 49.31,69.07 49.31,70 48.61,70.7 47.53,70.7 v1(46.77,71.46) ; v1(13.01,55.56) 14.01,56.55 19.93,56.55 21.66,58.28 21.66,60.82 22.52,61.68 23.6,61.68 25.18,63.27 25.18,67.9 26.71,69.43 32.8,69.43 34.96,71.59 41.82,71.59 v1(42.58,72.35)
  Bottom Layer w0.762: H14.1 9.16,55.56 v1(13.01,55.56) ; v1(46.77,71.46) 46.68,71.55 43.38,71.55 v1(42.58,72.35) 42.58,76.79 v1(42.71,76.92)
12V: length 141.4
  Top Layer w0.762: 18.92,63.27 22.39,63.27 23.56,64.44 23.56,70.66 22.21,72.01 CIN.1 ; 18.92,63.27 13.05,63.27 11.88,64.44 11.88,67.62 11.12,68.38 SW3.1 ; 18.92,63.27 18.92,58.61 v1(18.96,58.57) 13.57,58.57 11.59,56.6 v1(11.59,54.19) ; C5.1 18.07,81.42 17.47,80.82 17.47,75.62 16.93,75.08 16.45,75.08 16.09,74.71 16.09,72.89 ; 16.06,72.92 16.09,72.89 ; 16.09,72.89 16.09,72.75 ; 16.09,72.89 17.06,71.91 ; v1(11.59,51.65) H17.2
  Bottom Layer w0.762: H18.2 45.38,42.63 44.49,43.52 44.49,60.54 42.96,62.06 34.33,62.06 33.37,63.01 20.93,63.01 19.97,62.06 19.97,59.59 v1(18.96,58.57) ; v1(11.59,54.19) v1(11.59,51.65)
+5V: length 305.9
  Top Layer w0.762: 40.04,84.6 C9.2 ; R16.2 46.53,11.77 48.3,11.77 48.55,12.02 ; v1(46.14,43.9) 46.14,34.26 ; 46.14,34.26 51.46,34.26 舵机3（排针）.2 ; 46.14,34.26 v1(46.14,31.07) ; v1(41.72,1.7) 19.25,1.7 18.26,2.69 v1(18.26,4.62) ; v1(26.61,66.22) 27.37,65.46 27.37,61.33 U10.1 ; 51.85,54.95 51.85,54.88 52.87,53.87 H18.9 52.9,52.82 52.9,63.36 51.92,64.35 50.33,64.35 47.66,67.01 v1(45.12,67.01) ; 46.14,26.34 49.05,26.34 C12.1 ; 46.14,26.34 v1(46.14,28.53) ; 46.14,26.34 46.14,22.95 44.74,21.55 44.74,19.99 45.34,19.39 46.42,19.39 R13.2 48.01,19.29 48.55,18.75 48.55,16.34 ; 48.55,16.34 47.79,15.58 46.53,15.58 R15.2 ; 48.55,16.34 48.55,12.02 ; v1(18.26,9.2) C11.2 13.59,10.63 C6.2 13.62,10.84 13.62,12.53 13.05,13.11 C1.2 9.05,13.24 H17.9 10.99,16.06 13.59,16.06 14.13,16.6 14.13,24.6 13.12,25.61 H17.4 ; 48.55,12.02 48.55,8.34 48.04,7.83 46.83,7.83 ; 48.55,12.02 50.2,12.02 PS2.5 ; v1(40.87,72.82) 40.87,74.76 41.34,75.24 41.34,78.66 42.28,79.6 U5.3 44.65,83.73 C10.1 40.1,84.54 40.1,84.42 ; v1(40.87,70.28) CIN1.2 v1(43.72,68.41) ; C13.1 46.83,7.83 ; 46.83,7.83 46.83,7.84 R14.2 ; v1(36.61,88.73) 36.61,89.56 C7.2 36.55,90.57 35.82,91.3 29.75,91.3 29.22,90.76 29.12,90.76 舵机1（排针）.2 29.12,84.68 C8.1 28.19,83.74 21.53,83.74 20.77,84.51 20.77,86.67 19.63,87.81 16.2,87.81 15.18,86.79 15.18,84.13 15.97,83.34 L1.2 15.31,78.28 14.29,77.27 COUT.1 15.24,71.87 15.82,71.3 15.82,68.89 15.91,68.89 16.45,68.35 16.45,67.44 R1.2 17.52,66.22 v1(20.26,66.22) ; v1(45.35,54.82) 41.44,54.82 U11.3
  Bottom Layer w0.762: 46.14,54.82 46.14,62.56 v1(46.15,62.57) ; 46.14,54.82 v1(45.35,54.82) ; 46.14,54.82 46.14,45.93 ; 46.14,54.82 v1(51.85,54.82) ; v1(46.55,7.58) 43.28,7.58 42.74,7.04 42.74,2.72 v1(41.72,1.7) ; v1(36.61,88.73) 36.61,87.21 37.15,86.67 39.31,86.67 40.04,85.94 v1(40.04,84.67) ; v1(43.85,84.54) 43.85,88.86 舵机2（排针）.2 ; v1(18.26,9.2) v1(18.26,4.62) ; H18.4 46.9,45.17 46.14,45.93 ; 46.14,45.93 v1(46.14,43.9) ; v1(46.14,31.07) v1(46.14,28.53) ; v1(40.87,70.28) v1(40.87,72.82) ; v1(20.26,66.22) v1(26.61,66.22) ; v1(43.72,68.41) v1(45.12,67.01)
GND: length 293.5
  Top Layer w0.254: 44.64,75.02 U5.1 44.65,70.28 44.99,69.94 45.76,69.94 46.01,69.68 46.01,68.81 COUT1.2 45.92,68.79 43.98,66.85 ; H15.1 15.91,50.5 15.4,51.01 15.4,52.41 14.9,52.92 H14.2 5.88,52.92 4.86,51.9 4.86,20.41 ; 31.67,83.91 33.82,83.91 35.09,85.18 35.09,87.85 ; U5.4 38.98,84.14 C9.1 38.58,85.11 38.9,85.43 39.91,85.43 40.29,85.81 40.29,87.85 ; 42.2,57.49 42.71,58 42.71,58.89 43.09,59.27 46.77,59.27 47.15,59.65 47.15,62.56 47.14,62.57 47.15,62.58 47.15,65.74 46.77,66.13 44.71,66.13 43.98,66.85 ; 42.2,57.49 44.49,57.49 44.99,56.98 47.89,56.98 48.15,56.72 48.15,48.49 48.93,47.71 H18.6 51.6,46.44 53.76,46.44 54.14,46.06 54.14,31.84 53.88,31.58 舵机3（排针）.1 52.58,30.6 C12.2 ; 42.2,57.49 U11.2 ; U10.20 26.07,6.56 25.18,5.67 13.54,5.67 C6.1 9.52,5.71 8.93,6.31 C1.1 6.07,9.92 4.86,11.13 4.86,20.41 ; U10.20 28.48,11.77 29.12,11.13 29.12,6.18 30.52,4.78 50.58,4.78 51.47,5.67 PS2.6 50.33,8.21 49.95,7.83 49.95,6.24 C13.2 ; U10.20 U10.19 ; U10.20 25.06,11.77 23.91,10.63 C11.1 ; 舵机1（排针）.1 26.45,89.37 23.4,89.37 ; 40.29,87.85 40.55,88.11 40.55,89.43 舵机2（排针）.1 ; 40.29,87.85 46.89,87.85 47.16,87.58 C10.2 ; 40.29,87.85 35.09,87.85 ; R2.1 21.4,65.08 22.04,65.71 22.04,66.85 21.53,67.36 RFS.1 19.63,67.36 19.12,67.87 19.12,69.41 U4.4 ; 43.98,66.85 37.97,66.85 37.69,67.14 CIN1.1 ; 4.86,20.41 6.13,21.68 8.53,21.68 8.56,21.71 9.54,21.71 9.58,21.68 10.83,21.68 11.59,22.44 H17.6 ; U1.4 11.29,89.19 11.85,89.75 23.02,89.75 23.4,89.37 ; 23.4,89.37 23.4,85.81 C5.2 ; C7.1 35.09,89.56 35.09,87.85 ; U4.3 U4.4 ; U4.4 21.27,69.45 CIN.2
1_GS90: length 65.6
  Top Layer w0.254: v1(35.22,34.88) 35.22,25.49 34.2,24.47 U10.15 ; R11.2 v1(35.22,76.03) ; v1(35.22,63.46) v1(35.22,37.17)
  Bottom Layer w0.254: v1(35.22,76.03) v1(35.22,63.46) ; v1(35.22,37.17) v1(35.22,34.88)
2_GS90: length 127.6
  Top Layer w0.254: v1(28.23,10.5) 28.23,5.55 30.8,2.97 52.14,2.97 55.69,6.53 55.69,80.7 54.26,82.14 52.74,82.14 52.49,82.39 R12.2 ; U10.16 27.98,21.93 28.23,21.68 v1(28.23,13.04)
  Bottom Layer w0.254: v1(28.23,13.04) v1(28.23,10.5)
3_GS90: length 21
  Top Layer w0.254: R17.2 36.62,38.82 v1(36.61,38.82) ; U10.5 33.56,49.87 34.33,49.11 v1(34.33,39.46)
  Bottom Layer w0.254: v1(36.61,38.82) 34.96,38.82 v1(34.33,39.46)
ADO: length 23.6
  Top Layer w0.254: v1(20.23,34.76) 16.55,34.76 13.88,37.42 13.88,42.38 13.5,42.76 v1(12.61,42.76) ; H14.6 v1(10.45,42.76)
  Bottom Layer w0.254: v1(10.45,42.76) v1(12.61,42.76) ; U10.11 24.98,34.63 24.6,34.25 24.17,34.25 23.72,34.69 23.69,34.69 23.62,34.76 v1(20.23,34.76)
CLK: length 29.2
  Top Layer w0.254: PS2.1 51.34,20.79 v1(46.52,20.79) ; v1(44.74,30.57) 44.74,34.12 44.23,34.63 U11.11 ; v1(44.74,28.53) v1(44.74,23.2) 43.09,23.2 42.64,22.75 42.64,20.15 41.88,19.39 U11.17
  Bottom Layer w0.254: v1(46.52,20.79) 46.52,21.42 v1(44.74,23.2) ; v1(44.74,30.57) v1(44.74,28.53)
CMD: length 12.2
  Top Layer w0.254: PS2.3 51.47,15.58 v1(49.82,13.93) ; v1(47.53,13.93) 47.16,13.93 R16.1 46.52,14.06 46.26,14.31 U11.19
  Bottom Layer w0.254: v1(47.53,13.93) v1(49.82,13.93)
CS: length 10.8
  Top Layer w0.254: v1(49.82,17.09) 51.1,18.37 PS2.2 ; v1(47.28,17.09) R15.1 46.27,16.85 U11.18
  Bottom Layer w0.254: v1(47.28,17.09) v1(49.82,17.09)
DATA: length 31.4
  Top Layer w0.254: PS2.4 51.72,13.04 53.63,13.04 54.26,12.4 54.26,6.5 52.43,4.66 v1(51.6,4.66) ; U11.20 41.31,9.74 41.69,9.36 46.51,9.36 R14.1 46.13,9.35 45.12,8.34 v1(45.12,5.55)
  Bottom Layer w0.254: v1(51.6,4.66) 46.01,4.66 v1(45.12,5.55)
INT: length 38.8
  Bottom Layer w0.254: U11.12 41.31,32.22 40.26,33.27 14.99,33.27 14.13,34.12 14.13,39.2 12.99,40.34 9.18,40.34 H14.7
L_EN(B): length 35.7
  Top Layer w0.254: v1(24.29,17.99) 24.33,18.03 27.31,18.03 v1(27.34,17.99) ; H17.10 v1(13.24,17.99) ; v1(39.15,22.44) 39.15,18.37 38.77,17.99 v1(30.01,17.99) ; v1(15.02,17.99) v1(22.26,17.99) ; v1(39.15,23.83) 39.79,24.47 U11.15
  Bottom Layer w0.254: v1(39.15,22.44) v1(39.15,23.83) ; v1(27.34,17.99) v1(30.01,17.99) ; v1(13.24,17.99) v1(15.02,17.99) ; v1(24.29,17.99) 24.27,18.02 22.29,18.02 v1(22.26,17.99)
L_EN(F): length 32.3
  Top Layer w0.254: v1(24.29,20.53) 24.8,21.04 24.8,22.69 25.31,23.2 40.04,23.2 U11.16 ; v1(15.02,20.53) v1(22.26,20.53) ; H17.8 v1(13.24,20.53)
  Bottom Layer w0.254: v1(13.24,20.53) v1(15.02,20.53) ; v1(22.26,20.53) v1(24.29,20.53)
L_IN1(F): length 19.6
  Bottom Layer w0.254: U10.13 24.8,29.55 24.29,29.04 24.29,27.52 23.57,26.79 10.41,26.79 H17.1
L_IN2(F): length 19.4
  Bottom Layer w0.254: U10.14 25.18,27.01 24.55,26.37 24.55,25.1 23.78,24.34 10.58,24.34 9.31,25.61 H17.3
L_IN3(B): length 42.6
  Top Layer w0.254: v1(19.21,37.93) v1(19.21,44.54) ; H17.5 8.8,23.33 7.66,23.33 7.21,23.77 7.21,25.87 8.23,26.88 18.45,26.88 19.21,27.64 v1(19.21,33.99)
  Bottom Layer w0.254: v1(19.21,33.99) v1(19.21,37.93) ; v1(19.21,44.54) 19.21,45.81 19.85,46.44 25.18,46.44 U10.6
L_IN4(B): length 75
  Top Layer w0.254: v1(23.02,11.52) 23.02,35.01 23.91,35.9 40.04,35.9 U11.10 ; v1(23.02,9.61) 21.63,8.21 11.59,8.21 10.96,8.85 10.96,10.88 10.2,11.64 7.15,11.64 6.39,12.4 6.39,19.64 7.27,20.53 H17.7
  Bottom Layer w0.254: v1(23.02,9.61) v1(23.02,11.52)
NCS: length 21.8
  Top Layer w0.254: H14.5 v1(10.45,45.3)
  Bottom Layer w0.254: U10.9 14.64,39.71 13.88,40.47 13.88,44.66 13.24,45.3 v1(10.45,45.3)
R_EN(B): length 15
  Top Layer w0.254: U11.6 42.71,47.33 43.09,47.71 v1(43.09,48.09) ; v1(43.09,53.3) v1(47.53,53.3) ; v1(48.8,53.3) 49.82,53.3 H18.10
  Bottom Layer w0.254: v1(43.09,53.3) v1(43.09,48.09) ; v1(47.53,53.3) v1(48.8,53.3)
R_EN(F): length 13.4
  Top Layer w0.254: U11.7 48.55,44.79 48.8,45.04 v1(48.8,46.44)
  Bottom Layer w0.254: 50.33,50.25 48.8,48.73 v1(48.8,46.44)
R_IN1(F): length 14.3
  Top Layer w0.254: v1(47.28,39.71) 52.49,39.71 52.87,40.09 H18.1 ; v1(44.61,39.71) U11.9
  Bottom Layer w0.254: v1(47.28,39.71) v1(44.61,39.71)
R_IN2(F): length 14.7
  Top Layer w0.254: v1(44.61,41.49) 42.07,41.49 U11.8 ; v1(47.15,41.49) 47.41,41.74 47.41,43.39 47.91,43.9 52.23,43.9 52.87,44.54 H18.3
  Bottom Layer w0.254: v1(47.15,41.49) v1(44.61,41.49)
R_IN3(B): length 13
  Top Layer w0.254: v1(48.8,49.74) 48.8,49.14 49.06,48.89 52.07,48.89 52.87,48.09 H18.5 ; U11.5 41.44,49.74 v1(47.03,49.74)
  Bottom Layer w0.254: v1(48.8,49.74) v1(47.03,49.74)
R_IN4(B): length 12.6
  Top Layer w0.254: U11.4 42.2,51.52 47.03,51.52 v1(47.15,51.65) ; v1(48.8,51.65) 48.84,51.61 51.51,51.61 52.87,50.25
  Bottom Layer w0.254: v1(47.15,51.65) 47.25,51.55 48.71,51.55 v1(48.8,51.65)
RX: length 11.6
  Top Layer w0.254: U10.8 24.55,42.25 24.04,42.76 24.04,44.54 v1(23.15,45.42) ; 16.8,45.42 v1(20.23,45.42)
  Bottom Layer w0.254: v1(20.23,45.42) v1(23.15,45.42)
SCL: length 29.3
  Top Layer w0.254: H14.3 v1(10.45,50.38) ; v1(12.74,50.38) 14.51,50.38 15.02,49.87 15.02,38.31 16.16,37.17 v1(20.1,37.17) ; v1(22.77,37.17) U10.10
  Bottom Layer w0.254: v1(10.45,50.38) v1(12.74,50.38) ; v1(20.1,37.17) v1(22.77,37.17)
SDA: length 29.9
  Top Layer w0.254: v1(20.1,36.28) 15.91,36.28 14.39,37.8 14.39,47.2 13.88,47.71 v1(12.74,47.71) ; U10.12 25.69,32.09 24.17,33.61 v1(24.17,35.14) ; H14.4 v1(10.45,47.84)
  Bottom Layer w0.254: v1(10.45,47.84) 12.61,47.84 v1(12.74,47.71) ; v1(20.1,36.28) 23.02,36.28 v1(24.17,35.14)
TX: length 11.7
  Top Layer w0.254: U10.7 25.06,44.79 24.55,45.3 24.55,47.2 v1(23.78,47.96) ; H15.2 v1(20.23,47.96)
  Bottom Layer w0.254: v1(20.23,47.96) v1(23.78,47.96)
$1N4224: length 2.2
  Top Layer w0.254: CBS.1 17.78,73.75 U4.7
$1N4461: length 2.3
  Top Layer w0.254: U4.2 17.85,69.38 17.85,67.88 RFS.2
$1N4835: length 6.6
  Top Layer w0.254: U4.6 18.43,73.75 CBS.2 18.65,77.96 L1.1
$1N8242: length 13.5
  Top Layer w0.762: U1.2 U1.1
$1N14520: length 8.9
  Top Layer w0.254: v1(34.01,85.3) 34.01,88.92 33.44,89.49 舵机1（排针）.3
  Bottom Layer w0.254: v1(34.01,85.3) 35.22,84.1 v1(35.22,83.14)
$1N14637: length 10.9
  Top Layer w0.254: 舵机2（排针）.3 51.95,89.52 52.49,88.99 R12.1
$1N15469: length 15.1
  Top Layer w0.254: v1(44.61,38.44) 40.42,38.44 39.91,38.95 R17.1 ; v1(47.28,38.44) 51.22,38.44 51.6,38.06 舵机3（排针）.3
  Bottom Layer w0.254: v1(44.61,38.44) v1(47.28,38.44)
$1N18529: length 13.7
  Top Layer w0.762: SW3.2 10.1,70.92 11.29,72.11 U1.3
$1N18556: length 5.1
  Top Layer w0.254: v1(15.56,68) 15.56,67.41 R1.1 15.51,65.14 R2.2
  Bottom Layer w0.254: v1(15.56,68) 16.96,69.39 v1(17.09,69.39)

## Copper pours and planes (outline as drawn; the poured copper is in the pictures)
12V on Top Layer: 19.12,72.37 21.4,72.37 21.4,71.41 19.12,71.41
12V on Top Layer: 16.58,71.87 19.2,71.87 19.2,70.29 16.58,70.29
GND on Top Layer: -11.11,101.02 68.78,101.02 68.78,-6.68 -11.11,-6.68
GND on Bottom Layer: -11.49,103.81 78.3,103.81 78.3,-4.14 -11.49,-4.14

Small or netless copper shapes (teardrops, artwork), in the pictures only: 232 on Top Layer, 88 on Bottom Layer
